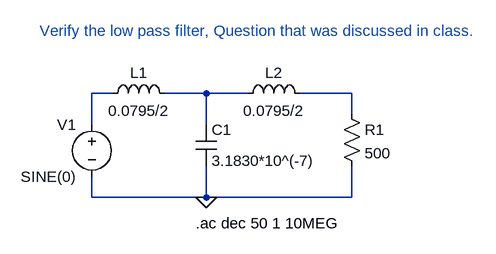
[diagram p0: schematic Lab9_ques1.asc]
Lab9_ques1.asc, the LTspice schematic file:
Version 4
SHEET 1 880 680
WIRE 144 176 112 176
WIRE 288 176 224 176
WIRE 352 176 288 176
WIRE 512 176 432 176
WIRE 512 208 512 176
WIRE 112 224 112 176
WIRE 288 224 288 176
WIRE 112 336 112 304
WIRE 288 336 288 288
WIRE 288 336 112 336
WIRE 512 336 512 288
WIRE 512 336 288 336
FLAG 288 336 0
SYMBOL Ind 128 192 R270
WINDOW 0 32 56 VTop 2
WINDOW 3 5 56 VBottom 2
SYMATTR InstName L1
SYMATTR Value 0.0795/2
SYMBOL Ind 336 192 R270
WINDOW 0 32 56 VTop 2
WINDOW 3 5 56 VBottom 2
SYMATTR InstName L2
SYMATTR Value 0.0795/2
SYMBOL Cap 272 224 R0
SYMATTR InstName C1
SYMATTR Value 3.1830*10^(-7)
SYMBOL Voltage 112 208 M0
SYMATTR InstName V1
SYMATTR Value SINE(0)
SYMATTR Value2 AC 5
SYMBOL Res 496 192 R0
SYMATTR InstName R1
SYMATTR Value 500
TEXT 272 376 Left 2 !.ac dec 50 1 10MEG
TEXT 32 80 Left 2 ;Verify the low pass filter, Question that was discussed in class.

The netlist it stands for:
* Lab9_ques1.asc
L1 N001 N002 0.0795/2
L2 N002 N003 0.0795/2
C1 N002 0 3.1830*10^(-7)
V1 N001 0 SINE(0) AC 5
R1 N003 0 500
.ac dec 50 1 10MEG
* Verify the low pass filter, Question that was discussed in class.
.backanno
.end